# EAGLE design LPS_Breakout (EAGLE 9.5.2)
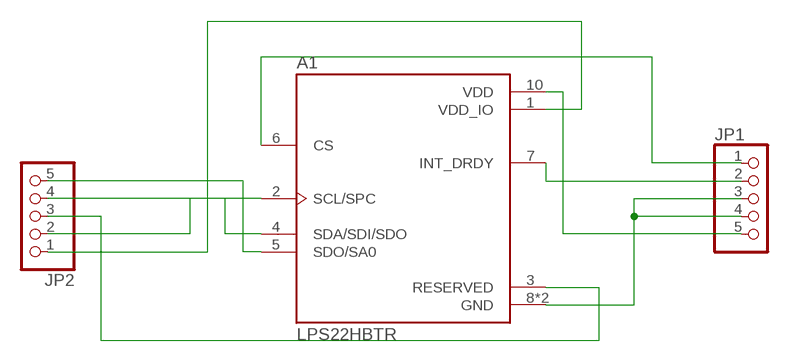
[diagram p0: schematic, sheet 1]

## Parts
A1  LPS22HBTR  [PQFN50P200X200X80-10N]
JP1  PINHD-1X5  [1X05]
JP2  PINHD-1X5  [1X05]

## Nets
N$1: A1.1(VDD_IO) JP2.1
N$2: A1.2(SCL/SPC) JP2.2
N$3: A1.3(RESERVED) JP2.3
N$4: A1.4(SDA/SDI/SDO) JP2.4
N$5: A1.5(SDO/SA0) JP2.5
N$6: A1.6(CS) JP1.1
N$8: A1.7(INT_DRDY) JP1.2
N$9: A1.8(GND) A1.9(GND) JP1.3 JP1.4
N$10: A1.10(VDD) JP1.5

## Library data of the parts
A1 = LPS22HBTR:LPS22HBTR: Pressure Sensor 3.77PSI ~ 18.27PSI (26kPa ~ 126kPa) Absolute 24 b 10-WFLGA Exposed Pad; DESCRIPTION: Pressure Sensor 3.77PSI ~ 18.27PSI (26kPa ~ 126kPa) Absolute 24 b 10-WFLGA Exposed Pad; DIGI-KEY_PART_NUMBER: 497-16265-1-ND; MF: STMicroelectronics; MP: LPS22HBTR; PACKAGE: WFLGA-10 STMicroelectronics; PURCHASE-URL: https://pricing.snapeda.com/search/part/LPS22HBTR/?ref=eda
JP1 JP2 = pinhead:PINHD-1X5: PIN HEADER

## Board
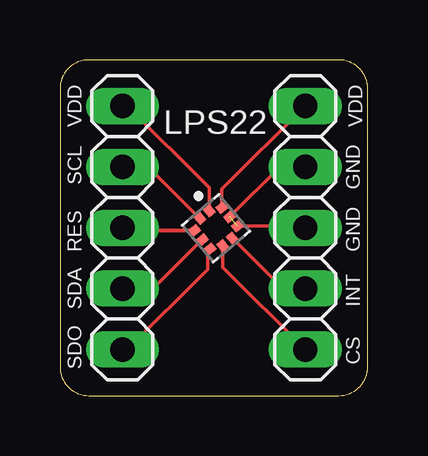
[diagram p1: board, top side]

Size 12.82 x 14 mm. Coordinates in mm from the lower left corner, seen from the top.
Outline: 12.82,1.2 12.82,12.8 arc90 11.62,14 1.2,14 arc90 0,12.8 0,1.2 arc90 1.2,0 11.62,0 arc90 12.82,1.2
Copper layers (1*16): Top 0.035mm / dielectric 1.5mm / Bottom 0.035mm
Design rules "default": minimum track width 6mil, minimum drill 0.35mm, track to track 6mil, track to pad 6mil, pad to pad 6mil, via to via 6mil, smd to smd 6mil, copper to edge 40mil, drill to drill 6mil, minimum pad ring 10mil, minimum via ring 8mil, stop-mask expansion 4mil, vias tented up to drill 0mil, thermal gap 10mil

### Footprints (pad centres in the part's own frame; a part is rotated, then mirrored left to right if it is on the bottom)
PQFN50P200X200X80-10N = smd 0.43 x 0.35: 1 -0.745,0.25; 2 -0.745,-0.25; 6 0.745,-0.25; 7 0.745,0.25 | smd 0.35 x 0.43: 3 -0.5,-0.745; 4 0,-0.745; 5 0.5,-0.745; 8 0.5,0.745; 9 0,0.745; 10 -0.5,0.745
1X05 = drill 1.016 long: 1 -5.08,0; 2 -2.54,0; 3 0,0; 4 2.54,0; 5 5.08,0

### Placement (x,y rotation side)
A1  6.5,6.98 310 top
JP1  10.22,7 90 top
JP2  2.6,7 270 top

### Tracks (layer width: path | path; a pad name or v marks a point on that pad's centre or on a via)
N$1
  Top 0.152: A1.1 6.21,8.67 2.8,12.08 JP2.1
N$2
  Top 0.152: A1.2 3.68,9.54 JP2.2
N$3
  Top 0.152: A1.3 2.72,6.88 JP2.3
N$4
  Top 0.152: A1.4 3.89,4.46 JP2.4
N$5
  Top 0.152: A1.5 6.15,6.02 6.15,5.27 2.8,1.92 JP2.5
N$6
  Top 0.152: A1.6 6.79,5.35 JP1.1
N$8
  Top 0.152: A1.7 9.28,4.46 JP1.2
N$9  (1 unrouted)
  Top 0.152: A1.9 9.15,9.54 JP1.4 | A1.8 10.14,7.08 JP1.3
N$10
  Top 0.152: A1.10 6.75,8.61 JP1.5

### Text on the board
tNames: VDD | LPS22 | VDD | SCL | GND | RES | GND | SDA | INT | SDO | CS